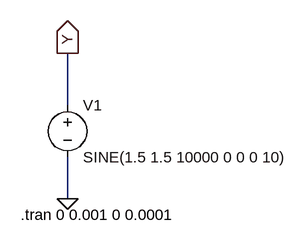
[diagram p0: schematic emulator-xr2202-output-sinewave.asc]
emulator-xr2202-output-sinewave.asc, the LTspice schematic file:
Version 4
SHEET 1 880 680
WIRE 112 112 112 32
WIRE 112 256 112 192
FLAG 112 32 Y
IOPIN 112 32 Out
FLAG 112 256 0
SYMBOL voltage 112 96 R0
WINDOW 123 0 0 Left 0
WINDOW 39 0 0 Left 0
SYMATTR InstName V1
SYMATTR Value SINE(1.5 1.5 10000 0 0 0 10)
TEXT 40 280 Left 2 !.tran 0 0.001 0 0.0001

The netlist it stands for:
* emulator-xr2202-output-sinewave.asc
V1 Y 0 SINE(1.5 1.5 10000 0 0 0 10)
.tran 0 0.001 0 0.0001
.backanno
.end